# Altium schematic sheet CR99500.SchDoc: CR00103
size A4; Organization: Trenz Elecronic GmbH; DocumentNumber: CR00103; Revision: 03; SheetNumber: 1; SheetTotal: 7; Date: 2022-04-08; CheckedBy: VT; Author: AL; CompanyName: Trenz Elecronic GmbH; DrawnBy: AL/VT; ModifiedDate: 2019-11-20
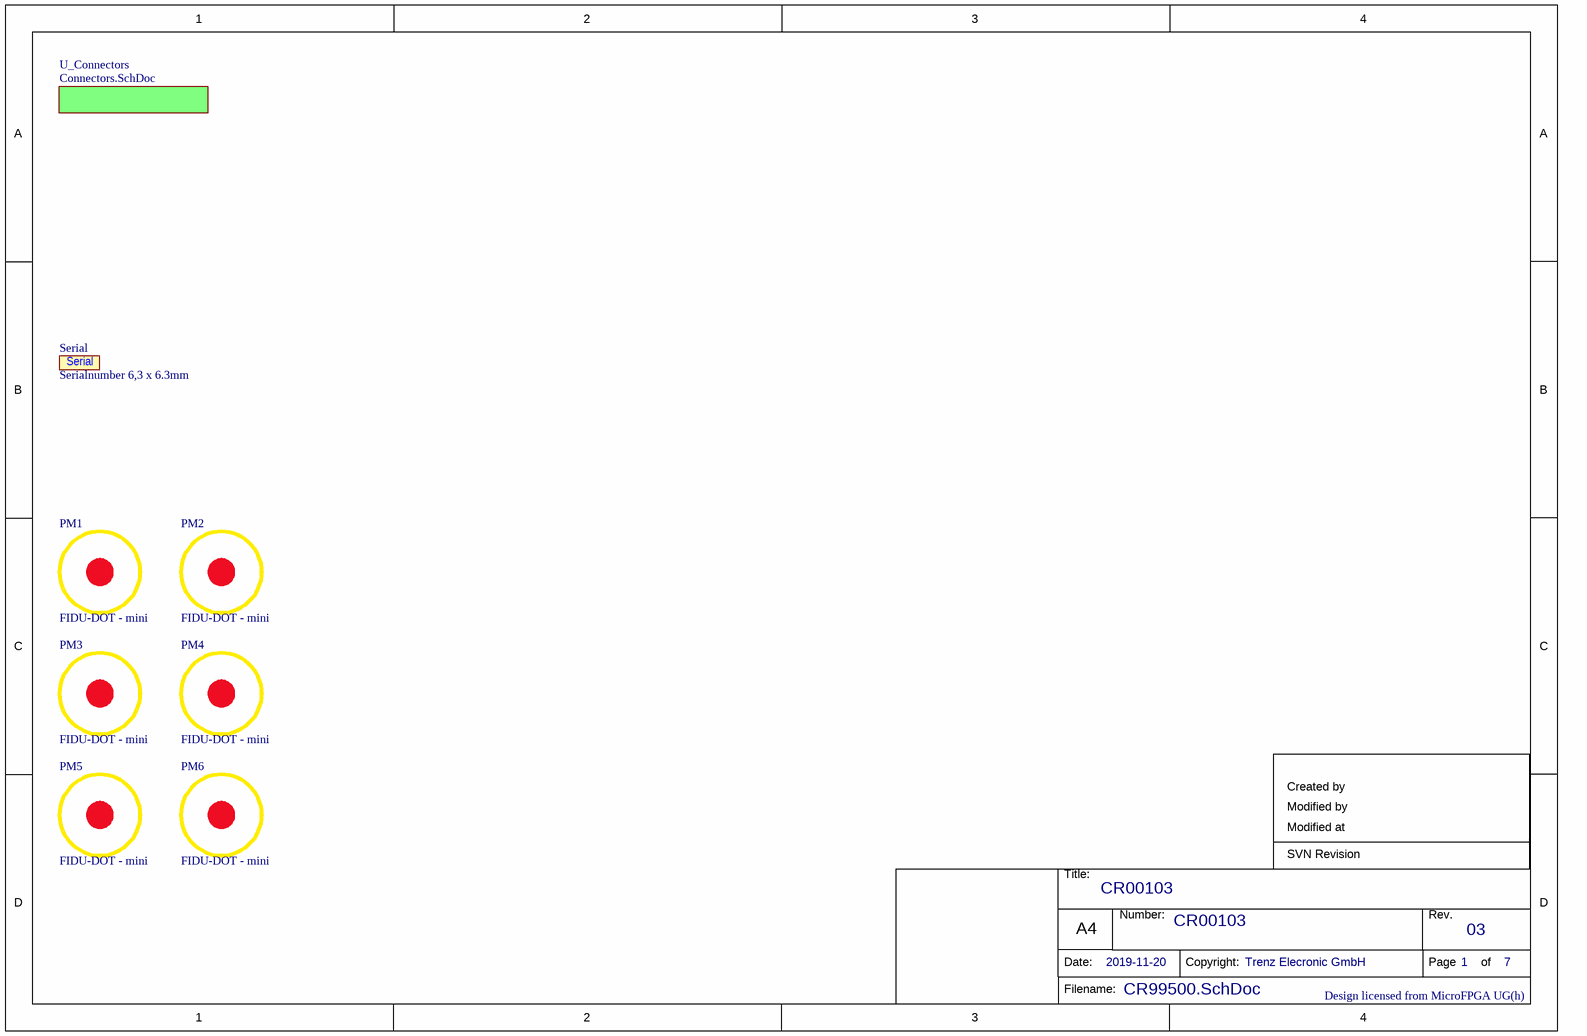
[diagram p0: CR99500.SchDoc]

## Parts
PM1  FIDU-DOT - mini  [FIDU-DOT - mini]
PM2  FIDU-DOT - mini  [FIDU-DOT - mini]
PM3  FIDU-DOT - mini  [FIDU-DOT - mini]
PM4  FIDU-DOT - mini  [FIDU-DOT - mini]
PM5  FIDU-DOT - mini  [FIDU-DOT - mini]
PM6  FIDU-DOT - mini  [FIDU-DOT - mini]
Serial  Serialnumber 6,3 x 6.3mm  [Serial_6.3x6.3mm]  (no BOM)

## Sub-sheets
U_Connectors = Connectors.SchDoc: no entries

## Notes on the sheet
- Created by
- Modified at
- Modified by
- SVN Revision
- Design licensed from MicroFPGA UG(h)
- Title:
- Number:
- Rev.
- Date:
- A4
- Copyright:
- Page
- of
- Filename:

## Library data of the parts
PM1-PM6 = 27037: FIDU-DOT - MINI 0.5mm; AN: 27037; Mixed: FIDU; Preferred: Yes
Serial = 26753: AN: 26753; H-ART: 39068; Mixed: MECH; Extra: THT-70-718-20